# Altium project NIR.PrjPCB
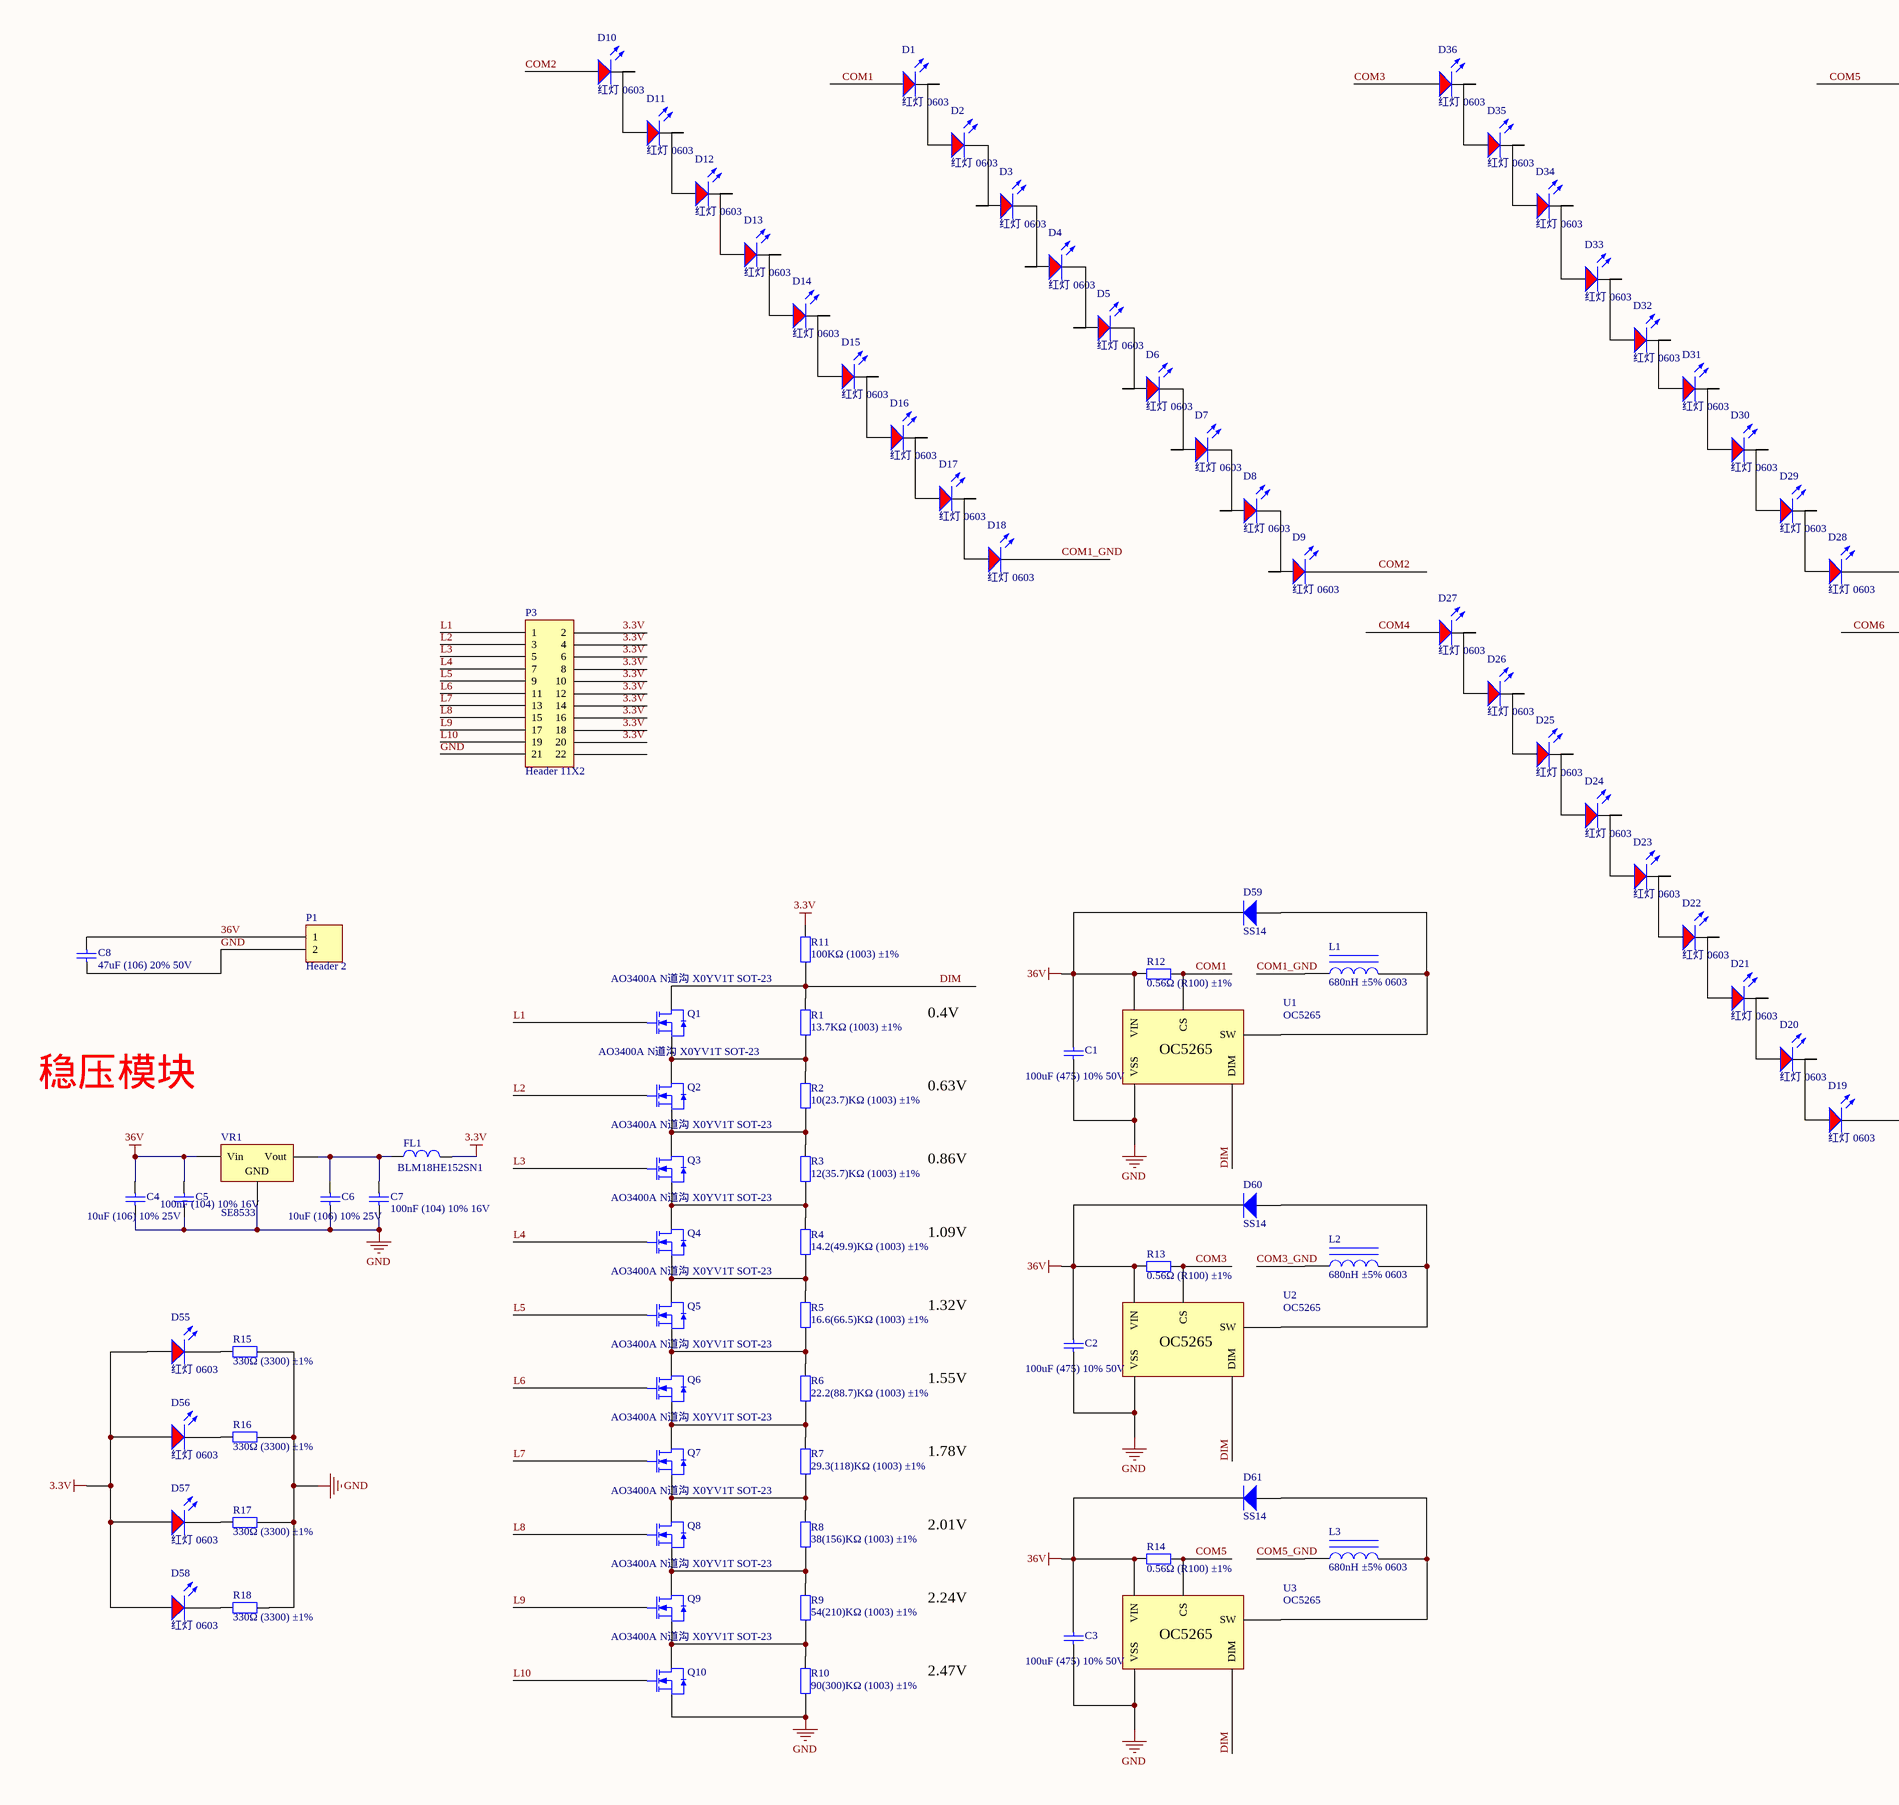
[diagram p0: NIRsheet.SchDoc, left]
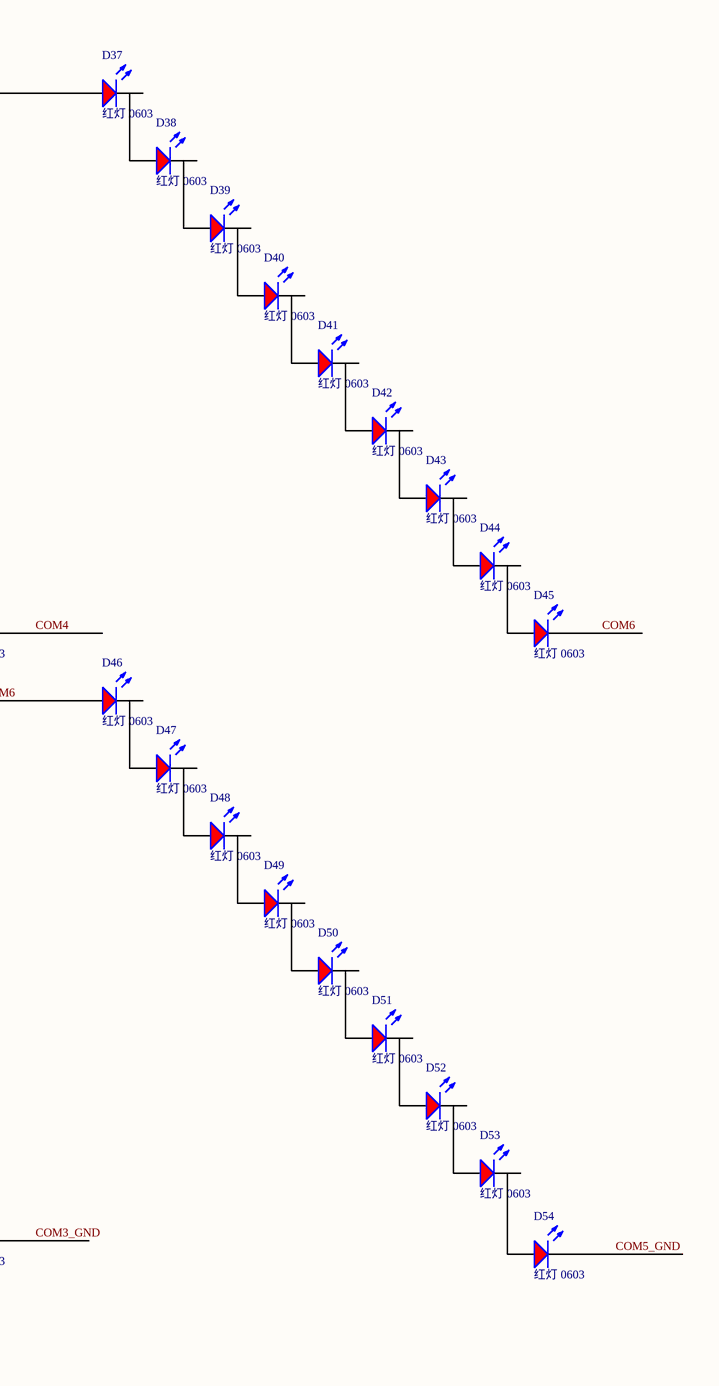
[diagram p1: NIRsheet.SchDoc, right]
1 sheet, 107 parts. Net scope: global (net labels, ports and power ports of the same name join across sheets).
Board file: NIR.PcbDoc

## Sheet NIRsheet.SchDoc
size A2

### Parts
C1  100uF (475) 10% 50V  [1206_C]
C2  100uF (475) 10% 50V  [1206_C]
C3  100uF (475) 10% 50V  [1206_C]
C4  10uF (106) 10% 25V  [0603_C]
C5  100nF (104) 10% 16V  [0603_C]
C6  10uF (106) 10% 25V  [0603_C]
C7  100nF (104) 10% 16V  [0603_C]
C8  47uF (106) 20% 50V  [470UF 35V]
D1  红灯 0603  [2385]
D2  红灯 0603  [2385]
D3  红灯 0603  [2385]
D4  红灯 0603  [2385]
D5  红灯 0603  [2385]
D6  红灯 0603  [2385]
D7  红灯 0603  [2385]
D8  红灯 0603  [2385]
D9  红灯 0603  [2385]
D10  红灯 0603  [2385]
D11  红灯 0603  [2385]
D12  红灯 0603  [2385]
D13  红灯 0603  [2385]
D14  红灯 0603  [2385]
D15  红灯 0603  [2385]
D16  红灯 0603  [2385]
D17  红灯 0603  [2385]
D18  红灯 0603  [2385]
D19  红灯 0603  [2385]
D20  红灯 0603  [2385]
D21  红灯 0603  [2385]
D22  红灯 0603  [2385]
D23  红灯 0603  [2385]
D24  红灯 0603  [2385]
D25  红灯 0603  [2385]
D26  红灯 0603  [2385]
D27  红灯 0603  [2385]
D28  红灯 0603  [2385]
D29  红灯 0603  [2385]
D30  红灯 0603  [2385]
D31  红灯 0603  [2385]
D32  红灯 0603  [2385]
D33  红灯 0603  [2385]
D34  红灯 0603  [2385]
D35  红灯 0603  [2385]
D36  红灯 0603  [2385]
D37  红灯 0603  [2385]
D38  红灯 0603  [2385]
D39  红灯 0603  [2385]
D40  红灯 0603  [2385]
D41  红灯 0603  [2385]
D42  红灯 0603  [2385]
D43  红灯 0603  [2385]
D44  红灯 0603  [2385]
D45  红灯 0603  [2385]
D46  红灯 0603  [2385]
D47  红灯 0603  [2385]
D48  红灯 0603  [2385]
D49  红灯 0603  [2385]
D50  红灯 0603  [2385]
D51  红灯 0603  [2385]
D52  红灯 0603  [2385]
D53  红灯 0603  [2385]
D54  红灯 0603  [2385]
D55  红灯 0603  [2385]
D56  红灯 0603  [2385]
D57  红灯 0603  [2385]
D58  红灯 0603  [2385]
D59  SS14  [SMA(DO-214AC)_S1]
D60  SS14  [SMA(DO-214AC)_S1]
D61  SS14  [SMA(DO-214AC)_S1]
FL1  BLM18HE152SN1  [0603_L]
L1  680nH ±5% 0603  [0603_L]
L2  680nH ±5% 0603  [0603_L]
L3  680nH ±5% 0603  [0603_L]
P1  Header 2  [DIP-2.54-2P]
P3  Header 11X2  [HDR2X11]
Q1  AO3400A N道沟 X0YV1T SOT-23  [SOT-23-3L]
Q2  AO3400A N道沟 X0YV1T SOT-23  [SOT-23-3L]
Q3  AO3400A N道沟 X0YV1T SOT-23  [SOT-23-3L]
Q4  AO3400A N道沟 X0YV1T SOT-23  [SOT-23-3L]
Q5  AO3400A N道沟 X0YV1T SOT-23  [SOT-23-3L]
Q6  AO3400A N道沟 X0YV1T SOT-23  [SOT-23-3L]
Q7  AO3400A N道沟 X0YV1T SOT-23  [SOT-23-3L]
Q8  AO3400A N道沟 X0YV1T SOT-23  [SOT-23-3L]
Q9  AO3400A N道沟 X0YV1T SOT-23  [SOT-23-3L]
Q10  AO3400A N道沟 X0YV1T SOT-23  [SOT-23-3L]
R1  13.7KΩ (1003) ±1%  [0603_R]
R2  10(23.7)KΩ (1003) ±1%  [0603_R]
R3  12(35.7)KΩ (1003) ±1%  [0603_R]
R4  14.2(49.9)KΩ (1003) ±1%  [0603_R]
R5  16.6(66.5)KΩ (1003) ±1%  [0603_R]
R6  22.2(88.7)KΩ (1003) ±1%  [0603_R]
R7  29.3(118)KΩ (1003) ±1%  [0603_R]
R8  38(156)KΩ (1003) ±1%  [0603_R]
R9  54(210)KΩ (1003) ±1%  [0603_R]
R10  90(300)KΩ (1003) ±1%  [0603_R]
R11  100KΩ (1003) ±1%  [0603_R]
R12  0.56Ω (R100) ±1%  [1206_R]
R13  0.56Ω (R100) ±1%  [1206_R]
R14  0.56Ω (R100) ±1%  [1206_R]
R15  330Ω (3300) ±1%  [0603_R]
R16  330Ω (3300) ±1%  [0603_R]
R17  330Ω (3300) ±1%  [0603_R]
R18  330Ω (3300) ±1%  [0603_R]
U1  OC5265  [SOT-89-5]
U2  OC5265  [SOT-89-5]
U3  OC5265  [SOT-89-5]
VR1  SE8533  [SOT-89(SOT-89-3)]

### Nets
3.3V: D55.A D56.A D57.A D58.A FL1.2 P3.2 P3.4 P3.6 P3.8 P3.10 P3.12 P3.14 P3.16 P3.18 P3.20 R11.1
36V: C1.2 C2.2 C3.2 C4.2 C5.2 C8.2 D59.2(K) D60.2(K) D61.2(K) P1.1 R12.1 R13.1 R14.1 U1.VIN U2.VIN U3.VIN VR1.3(Vin)
GND: C1.1 C2.1 C3.1 C4.1 C5.1 C6.1 C7.1 C8.1 P1.2 P3.21 Q10.2(S) R10.1 R15.2 R16.2 R17.2 R18.2 U1.VSS U2.VSS U3.VSS VR1.1(GND)
COM1: D1.A R12.2 U1.CS
COM1_GND: D18.K L1.1
COM2: D9.K D10.A
COM3: D36.A R13.2 U2.CS
COM3_GND: D19.K L2.1
COM4: D27.A D28.K
COM5: D37.A R14.2 U3.CS
COM5_GND: D54.K L3.1
COM6: D45.K D46.A
DIM: Q1.3(D) R1.2 R11.2 U1.DIM U2.DIM U3.DIM
L1: P3.1 Q1.1(G)
L2: P3.3 Q2.1(G)
L3: P3.5 Q3.1(G)
L4: P3.7 Q4.1(G)
L5: P3.9 Q5.1(G)
L6: P3.11 Q6.1(G)
L7: P3.13 Q7.1(G)
L8: P3.15 Q8.1(G)
L9: P3.17 Q9.1(G)
L10: P3.19 Q10.1(G)
NetC6_2: C6.2 C7.2 FL1.1 VR1.2(Vout)
NetD1_K: D1.K D2.A
NetD2_K: D2.K D3.A
NetD3_K: D3.K D4.A
NetD4_K: D4.K D5.A
NetD5_K: D5.K D6.A
NetD6_K: D6.K D7.A
NetD7_K: D7.K D8.A
NetD8_K: D8.K D9.A
NetD10_K: D10.K D11.A
NetD11_K: D11.K D12.A
NetD12_K: D12.K D13.A
NetD13_K: D13.K D14.A
NetD14_K: D14.K D15.A
NetD15_K: D15.K D16.A
NetD16_K: D16.K D17.A
NetD17_K: D17.K D18.A
NetD19_A: D19.A D20.K
NetD20_A: D20.A D21.K
NetD21_A: D21.A D22.K
NetD22_A: D22.A D23.K
NetD23_A: D23.A D24.K
NetD24_A: D24.A D25.K
NetD25_A: D25.A D26.K
NetD26_A: D26.A D27.K
NetD28_A: D28.A D29.K
NetD29_A: D29.A D30.K
NetD30_A: D30.A D31.K
NetD31_A: D31.A D32.K
NetD32_A: D32.A D33.K
NetD33_A: D33.A D34.K
NetD34_A: D34.A D35.K
NetD35_A: D35.A D36.K
NetD37_K: D37.K D38.A
NetD38_K: D38.K D39.A
NetD39_K: D39.K D40.A
NetD40_K: D40.K D41.A
NetD41_K: D41.K D42.A
NetD42_K: D42.K D43.A
NetD43_K: D43.K D44.A
NetD44_K: D44.K D45.A
NetD46_K: D46.K D47.A
NetD47_K: D47.K D48.A
NetD48_K: D48.K D49.A
NetD49_K: D49.K D50.A
NetD50_K: D50.K D51.A
NetD51_K: D51.K D52.A
NetD52_K: D52.K D53.A
NetD53_K: D53.K D54.A
NetD55_K: D55.K R15.1
NetD56_K: D56.K R16.1
NetD57_K: D57.K R17.1
NetD58_K: D58.K R18.1
NetD59_1: D59.1(A) L1.2 U1.SW
NetD60_1: D60.1(A) L2.2 U2.SW
NetD61_1: D61.1(A) L3.2 U3.SW
NetQ1_2: Q1.2(S) Q2.3(D) R1.1 R2.2
NetQ2_2: Q2.2(S) Q3.3(D) R2.1 R3.2
NetQ3_2: Q3.2(S) Q4.3(D) R3.1 R4.2
NetQ4_2: Q4.2(S) Q5.3(D) R4.1 R5.2
NetQ5_2: Q5.2(S) Q6.3(D) R5.1 R6.2
NetQ6_2: Q6.2(S) Q7.3(D) R6.1 R7.2
NetQ7_2: Q7.2(S) Q8.3(D) R7.1 R8.2
NetQ8_2: Q8.2(S) Q9.3(D) R8.1 R9.2
NetQ9_2: Q9.2(S) Q10.3(D) R9.1 R10.2

Not connected (* = marked no-connect by the designer): P3 22

### Notes on the sheet
- 0.4V
- 稳压模块
- 0.63V
- 0.86V
- 1.09V
- 1.32V
- 1.55V
- 1.78V
- 2.01V
- 2.24V
- 2.47V

### Library data of the parts
C1-C3 = 1206 4.7uF (475) 10% 50V: 贴片电容; ComponentLink1Description: 供应商链接; ComponentLink1URL: http://www.szlcsc.com/product/details_30577.html; Package: 1206; Supplier: LC; SuppliersPartNumber: C29823
C4 C6 = 0805 10uF (106) 10% 25V: 贴片电容; ComponentLink1Description: 供应商链接; ComponentLink1URL: http://www.szlcsc.com/product/details_16532.html; Package: 0805; Supplier: LC; SuppliersPartNumber: C15850
C5 C7 = 0402 100nF (104) 10% 16V: 贴片电容; ComponentLink1Description: 供应商链接; ComponentLink1URL: http://www.szlcsc.com/product/details_1877.html; Package: 0402; Supplier: LC; SuppliersPartNumber: C1525
C8 = 0402 10uF (106) 20% 6.3V: 贴片电容; ComponentLink1Description: 供应商链接; ComponentLink1URL: http://www.szlcsc.com/product/details_16204.html; Package: 0402; Supplier: LC; SuppliersPartNumber: C15525
D1-D58 = 0603 红灯: 发光二极管; ComponentLink1Description: 供应商链接; ComponentLink1URL: http://www.szlcsc.com/product/details_2659.html; Package: 0603; Supplier: LC; SuppliersPartNumber: C2286
D59-D61 = SMA(DO-214AC) SS54: 二极管; ComponentLink1Description: 供应商链接; ComponentLink1URL: http://www.szlcsc.com/product/details_23178.html; Package: SMA(DO-214AC); Supplier: LC; SuppliersPartNumber: C22452
FL1 = IND_DM_1MH_2.5A: 差模电感1mH/2.5A; Text Field1: 29.5mm; Text Field2: 43120014; Text Field3: HI
L1-L3 = 0603 68nH 5% 0603: 贴片电感; ComponentLink1Description: 供应商链接; ComponentLink1URL: http://www.szlcsc.com/product/details_14064.html; Package: 0603; Supplier: LC; SuppliersPartNumber: C13415
P1 = Header 2: Header, 2-Pin; LatestRevisionDate: 17-Jul-2002; LatestRevisionNote: Re-released for DXP Platform.; Publisher: Altium Limited
P3 = Header 11X2: Header, 11-Pin, Dual row; LatestRevisionDate: 17-Jul-2002; LatestRevisionNote: Re-released for DXP Platform.; Publisher: Altium Limited
Q1-Q10 = AO3400A N道沟 X0YV1T SOT-23: MOS(场效应管); ComponentLink1Description: 供应商链接; ComponentLink1URL: http://www.szlcsc.com/product/details_21629.html; Package: SOT-23; Supplier: LC; SuppliersPartNumber: C20917
R1-R11 = 0603 100KΩ (1003) 1%: 贴片电阻; ComponentLink1Description: 供应商链接; ComponentLink1URL: http://www.szlcsc.com/product/details_26546.html; Package: 0603; Supplier: LC; SuppliersPartNumber: C25803
R12-R14 = 1206 0.1Ω (R100) 1%: 贴片电阻; ComponentLink1Description: 供应商链接; ComponentLink1URL: http://www.szlcsc.com/product/details_26077.html; Package: 1206; Supplier: LC; SuppliersPartNumber: C25334
R15-R18 = 0603 330Ω (3300) 1%: 贴片电阻; ComponentLink1Description: 供应商链接; ComponentLink1URL: http://www.szlcsc.com/product/details_23865.html; Package: 0603; Supplier: LC; SuppliersPartNumber: C23138
U1-U3 = OC5265: pin to pad: CS>4 DIM>3 SW>1 VIN>5 VSS>2
VR1 = SOT-223 AMS1117-3.3: 低压差线性稳压(LDO); ComponentLink1Description: 供应商链接; ComponentLink1URL: http://www.szlcsc.com/product/details_6652.html; Package: SOT-223; Supplier: LC; SuppliersPartNumber: C6186